# Altium schematic sheet NIXIE_3.SchDoc
size A4; SheetNumber: 6; SheetTotal: 6
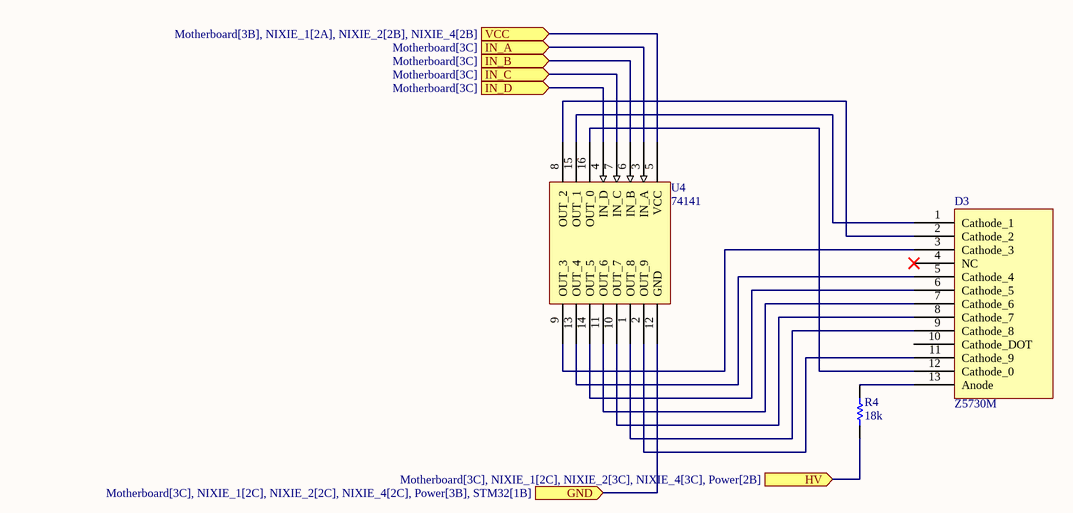
[diagram p0: NIXIE_3.SchDoc]

## Parts
D3  Z5730M  [Z5730M]
R4  18k  [RESC2013X60X40LL20T25]
U4  74141  [DIP-16]

## Ports
GND (in, see Motherboard[3C], NIXIE_1[2C], NIXIE_2[2C], NIXIE_4[2C], Power[3B], STM32[1B]), HV (in, see Motherboard[3C], NIXIE_1[2C], NIXIE_2[3C], NIXIE_4[3C], Power[2B]), IN_A (in, see Motherboard[3C]), IN_B (in, see Motherboard[3C]), IN_C (in, see Motherboard[3C]), IN_D (in, see Motherboard[3C]), VCC (in, see Motherboard[3B], NIXIE_1[2A], NIXIE_2[2B], NIXIE_4[2B])

## Nets
GND: U4.12(GND) ; port GND
HV: R4.1 ; port HV
IN_A: U4.3(IN_A) ; port IN_A
IN_B: U4.6(IN_B) ; port IN_B
IN_C: U4.7(IN_C) ; port IN_C
IN_D: U4.4(IN_D) ; port IN_D
VCC: U4.5(VCC) ; port VCC
NetD3_1: D3.1(Cathode_1) U4.15(OUT_1)
NetD3_2: D3.2(Cathode_2) U4.8(OUT_2)
NetD3_3: D3.3(Cathode_3) U4.9(OUT_3)
NetD3_5: D3.5(Cathode_4) U4.13(OUT_4)
NetD3_6: D3.6(Cathode_5) U4.14(OUT_5)
NetD3_7: D3.7(Cathode_6) U4.11(OUT_6)
NetD3_8: D3.8(Cathode_7) U4.10(OUT_7)
NetD3_9: D3.9(Cathode_8) U4.1(OUT_8)
NetD3_11: D3.11(Cathode_9) U4.2(OUT_9)
NetD3_12: D3.12(Cathode_0) U4.16(OUT_0)
NetD3_13: D3.13(Anode) R4.2

Not connected (* = marked no-connect by the designer): D3 4(NC)* 10(Cathode_DOT)

## Library data of the parts
R4 = CMP-2001-00606-1: Manufacturer: Panasonic; Part Number: ERA6AEB183V